# EAGLE schematic Robot (EAGLE 9.6.2)
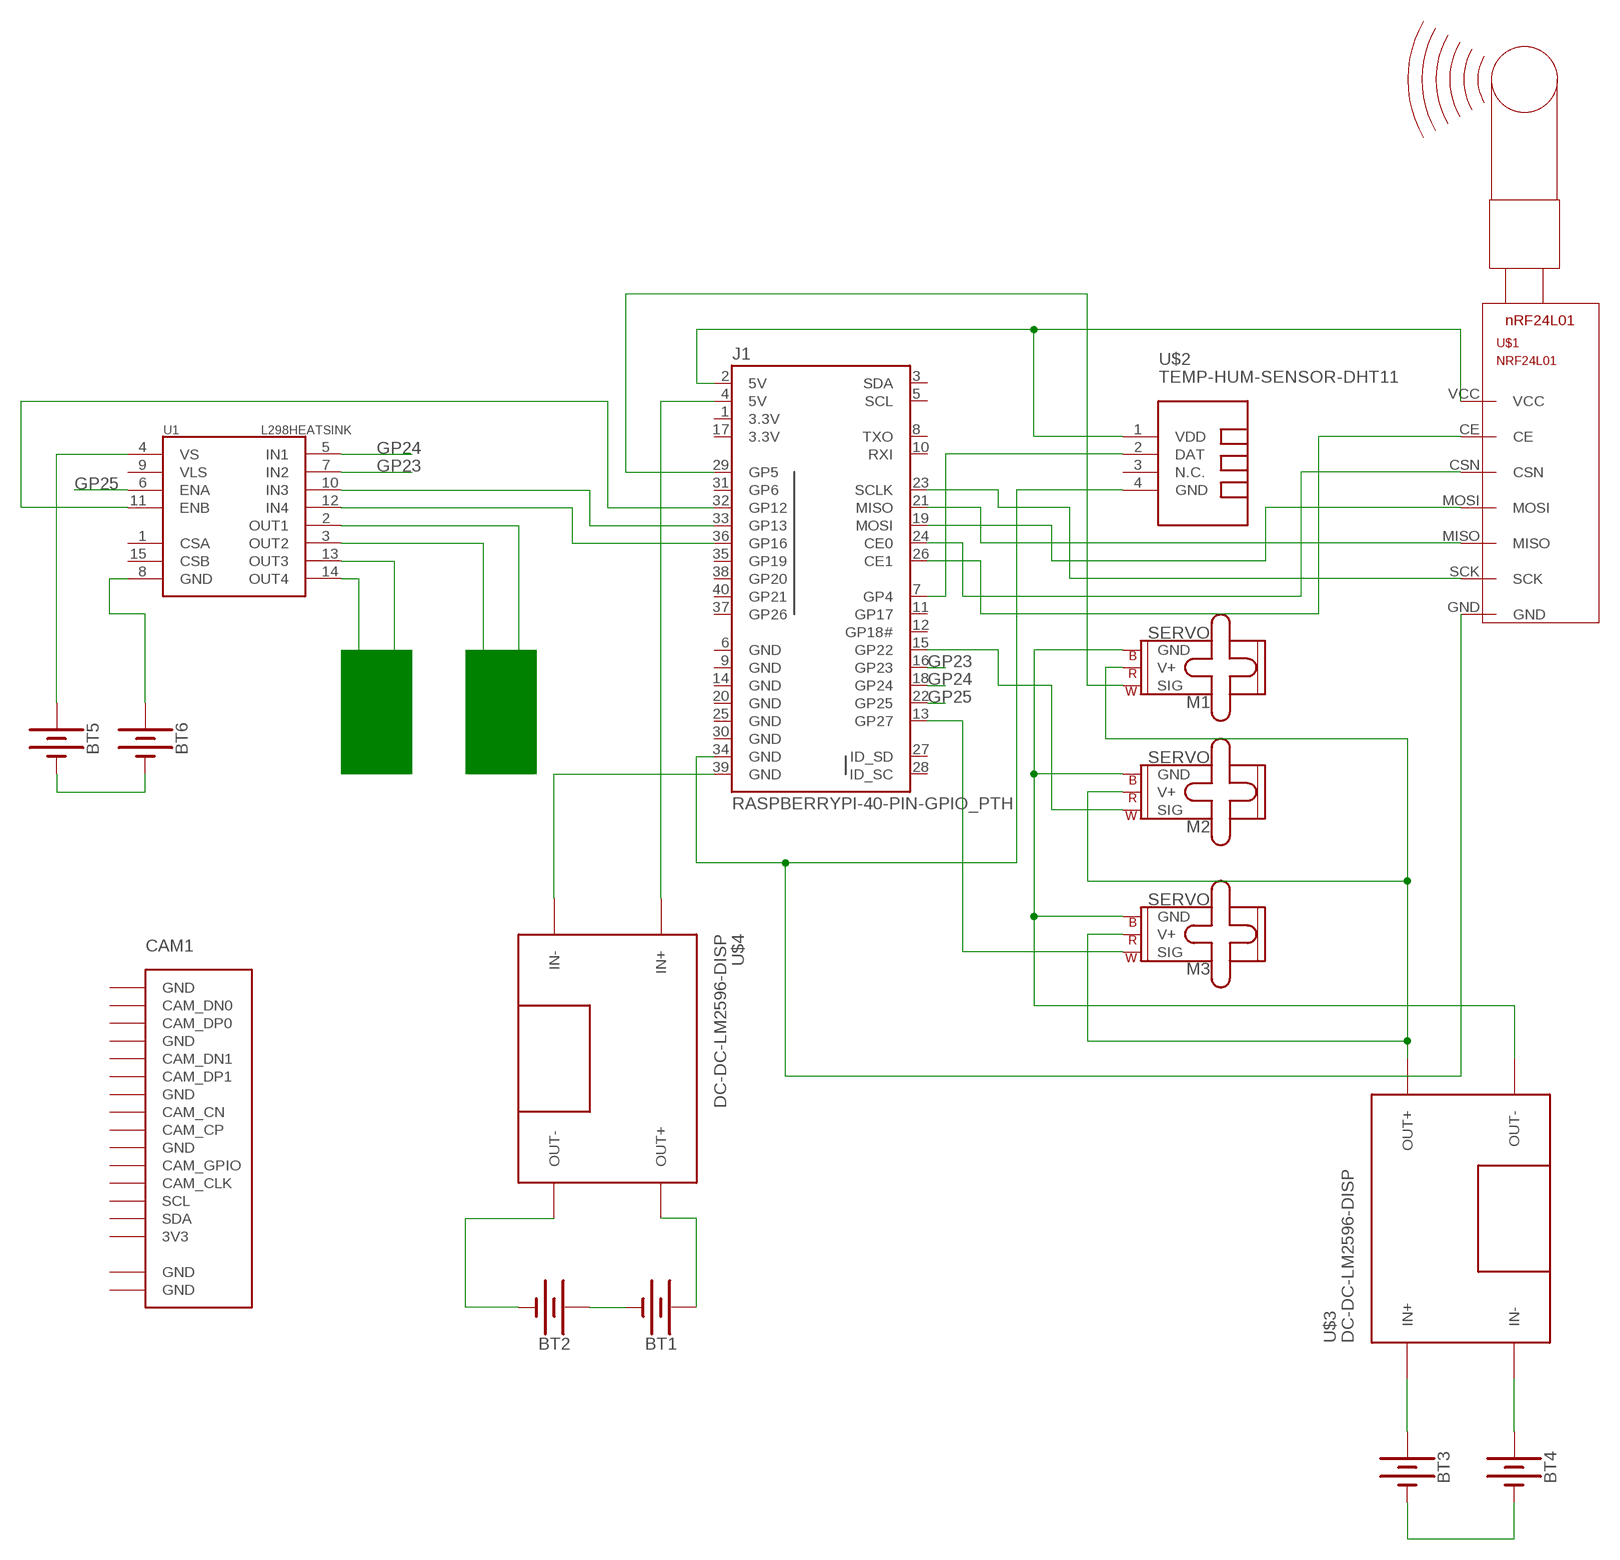
[diagram p0: schematic, sheet 1]

## Parts
BT1  BATTERY-18650  [BATTERY_18650-HOLDER]
BT2  BATTERY-18650  [BATTERY_18650-HOLDER]
BT3  BATTERY-18650  [BATTERY_18650-HOLDER]
BT4  BATTERY-18650  [BATTERY_18650-HOLDER]
BT5  BATTERY-18650  [BATTERY_18650-HOLDER]
BT6  BATTERY-18650  [BATTERY_18650-HOLDER]
CAM1  RASPI_CAM  [FFC-15]
J1  RASPBERRYPI-40-PIN-GPIO_PTH  [2X20_SHROUDED]
M1  SERVO  [1X03]
M2  SERVO  [1X03]
M3  SERVO  [1X03]
U1  L298HEATSINK  [MULTIWATT15_6400BGHEATSINK]
U$1  NRF24L01  [NRF24L01]
U$2  TEMP-HUM-SENSOR-DHT11  [TEMP-HUM-SENSOR-DHT11]
U$3  DC-DC-LM2596-DISP  [DC-DC-LM2596-DISP]
U$4  DC-DC-LM2596-DISP  [DC-DC-LM2596-DISP]

## Nets
GP23: J1.16(GP23) U1.7(IN2)
GP24: J1.18(GP24) U1.5(IN1)
GP25: J1.22(GP25) U1.6(ENA)
N$1: U1.14(OUT4)
N$2: U1.13(OUT3)
N$3: U1.3(OUT2)
N$4: U1.2(OUT1)
N$5: BT5.GND@1(-) BT6.GND@1(-)
N$6: BT6.PWR@1(+) U1.8(GND)
N$7: BT5.PWR@1(+) U1.4(VS)
N$8: BT1.GND@1(-) BT2.PWR@1(+)
N$9: BT1.PWR@1(+) U$4.OUT+
N$10: BT2.GND@1(-) U$4.OUT-
N$11: J1.4(5V) U$4.IN+
N$12: J1.39(GND) U$4.IN-
N$13: J1.2(5V) U$1.VCC U$2.1(VDD)
N$14: J1.34(GND) U$1.GND U$2.4(GND)
N$15: J1.7(GP4) U$2.2(DAT)
N$16: BT3.GND@1(-) BT4.GND@1(-)
N$17: BT3.PWR@1(+) U$3.IN+
N$18: BT4.PWR@1(+) U$3.IN-
N$19: J1.29(GP5) M1.1(SIG)
N$20: J1.15(GP22) M2.1(SIG)
N$21: J1.13(GP27) M3.1(SIG)
N$22: M1.2(V+) M2.2(V+) M3.2(V+) U$3.OUT+
N$23: M1.3(GND) M2.3(GND) M3.3(GND) U$3.OUT-
N$24: J1.21(MISO) U$1.MISO
N$25: J1.19(MOSI) U$1.MOSI
N$26: J1.23(SCLK) U$1.SCK
N$27: J1.24(CE0) U$1.CSN
N$28: J1.26(CE1) U$1.CE
N$30: J1.32(GP12) U1.11(ENB)
N$31: J1.33(GP13) U1.10(IN3)
N$32: J1.36(GP16) U1.12(IN4)
Unconnected: CAM1.P$1(GND) CAM1.P$2(CAM_DN0) CAM1.P$3(CAM_DP0) CAM1.P$4(GND) CAM1.P$5(CAM_DN1) CAM1.P$6(CAM_DP1) CAM1.P$7(GND) CAM1.P$8(CAM_CN) CAM1.P$9(CAM_CP) CAM1.P$10(GND) CAM1.P$11(CAM_GPIO) CAM1.P$12(CAM_CLK) CAM1.P$13(SCL) CAM1.P$14(SDA) CAM1.P$15(3V3) CAM1.P$16(GND) CAM1.P$17(GND) J1.3(SDA) J1.5(SCL) J1.8(TXO) J1.10(RXI) J1.11(GP17) J1.12(GP18#) J1.27(ID_SD) J1.28(ID_SC) J1.31(GP6) J1.35(GP19) J1.37(GP26) J1.38(GP20) J1.40(GP21) U1.1(CSA) U1.9(VLS) U1.15(CSB) U$2.3(N.C.)

## Power pins joined to a net without a drawn wire
3.3V: J1.1(3.3V) J1.17(3.3V)
GND: J1.6(GND) J1.9(GND) J1.14(GND) J1.20(GND) J1.25(GND) J1.30(GND)

## Library data of the parts
BT1-BT6 = SparkFun-Batteries:BATTERY: Battery - Single Cell A variety of battery chemistries, sizes, and footprints. Device List: 20MM_PTH - Coin Cell Battery Holder - 20mm (PTH) <https://www.sparkfun.com/products/783> 6.8MM_PTH - Coin Cell Battery Holder - 6.8MM(SMD) <https://www.digikey.com/product-detail/en/seiko-instruments/MS621FE-FL11E/728-1057-ND/1889208?WT.srch=1&gclid=CNOQ5a6LzdQCFZS2wAodXCkE0g> 12MM_SMD - Coin Cell Battery Holder - 12mm (SMD) <https://www.sparkfun.com/products/10592> 12MM_PTH - Coin Cell Battery Holder - 12mm (PTH) <https://www.sparkfun.com/products/7948> 20MM_SMD - 20mm Coin Cell Battery Holder (SMD) (2 legs) Used on the Big Time Watch Kit <https://www.sparkfun.com/products/11734> 20MM_SMD_4LEGS - Coin Cell Battery Holder - 20mm (SMD) <https://www.sparkfun.com/products/11892> 20MM_SMD_4LEGS_OVERPASTE - Coin Cell Battery Holder - 20mm (SMD) <https://www.sparkfun.com/products/11892> (Over-paste on the legs) 24.5MM_PTH - Coin Cell Battery Holder - 24.5mm (PTH) <https://www.sparkfun.com/products/8863> 9V - 9V Battery Holder - PC Mount Used on the SparkFun SparkPunk Sound Kit <https://www.sparkfun.com/products/11177> and SparkFun SparkPunk Sequencer Kit <https://www.sparkfun.com/products/12707> 18650 - Battery Holder - 18650 (PTH) <https://www.sparkfun.com/products/13113> AA - Battery Holder - 1xAA (PTH) <https://www.sparkfun.com/products/7949> AAA - Battery Holder - 1xAAA (PTH) <https://www.sparkfun.com/products/12718> AA_KIT - Battery Holder - 1xAA (PTH) <https://www.sparkfun.com/products/7949> Special kit package - pads only have exposed copper on one side of the board. AAA_KIT - Battery Holder - 1xAAA (PTH) <https://www.sparkfun.com/products/12718> Special kit package - pads only have exposed copper on one side of the board.; PROD_ID: BATT-12327; SF_SKU: PRT-13113
CAM1 = raspberrypi_cm:RASPI_CAM: Raspberry Pi camera connector www.hasseb.fi
J1 = SparkFun-Connectors:RASPBERRYPI-40-PIN-GPIO: Raspberry Pi GPIO Header 2x20 pin connector, as found on B, B+, A+ models. Both shrouded PTH and SMT versions available. SparkFun Products: GPIO Shrouded Header <https://www.sparkfun.com/products/13054>- PTH SparkFun Pi Wedge (Preassembled) <https://www.sparkfun.com/products/13717>; PROD_ID: CONN-12263; SF_ID: PRT-13054
M1-M3 = SparkFun-Electromechanical:SERVO: Servo Motor 3-pin connector for a standard servo motor (voltage supply, ground, and control signal.) SparkFun Products Servo - Generic (Sub-Micro Size) <https://www.sparkfun.com/products/9065> (ROB-09065) Servo - Generic High Torque Continuous Rotation (Standard Size) <https://www.sparkfun.com/products/9347> (ROB-09347) Servo - Generic High Torque (Standard Size) <https://www.sparkfun.com/products/11965> (ROB-11965)
U1 = SparkFun-IC-Special-Function:L298: L298 Dual Full Bridge Driver
U$1 = Clean-Kong (1):NRF24L01: nrF54L01 2.4GHz with 100 Channels Emitter/Reveiver SPI Controlled Roboshop / Minint
U$2 = diy-modules (3):TEMP-HUM-SENSOR-DHT11: DHT11 - digital humidity & temperature sensor DHT11 datasheet available here: https://akizukidenshi.com/download/ds/aosong/DHT11.pdf Click here to find device on ebay.com <http://www.ebay.com/sch/dht11+digital+sensor>
U$3 U$4 = diy-modules (3):DC-DC-LM2596-DISP: DC/DC Step-Down Regulator with Voltage Display based on LM2596-ADJ chip More details available here: http://www.instructables.com/id/The-Introduction-of-LM2596-Step-Down-Power-Module-/ LM2596 datasheet available here: http://www.ti.com/lit/ds/symlink/lm2596.pdf Click here to find device on ebay.com <http://www.ebay.com/sch/lm2596+led+voltmeter+40>